# Altium schematic sheet ShiftRegs.SchDoc
size A3
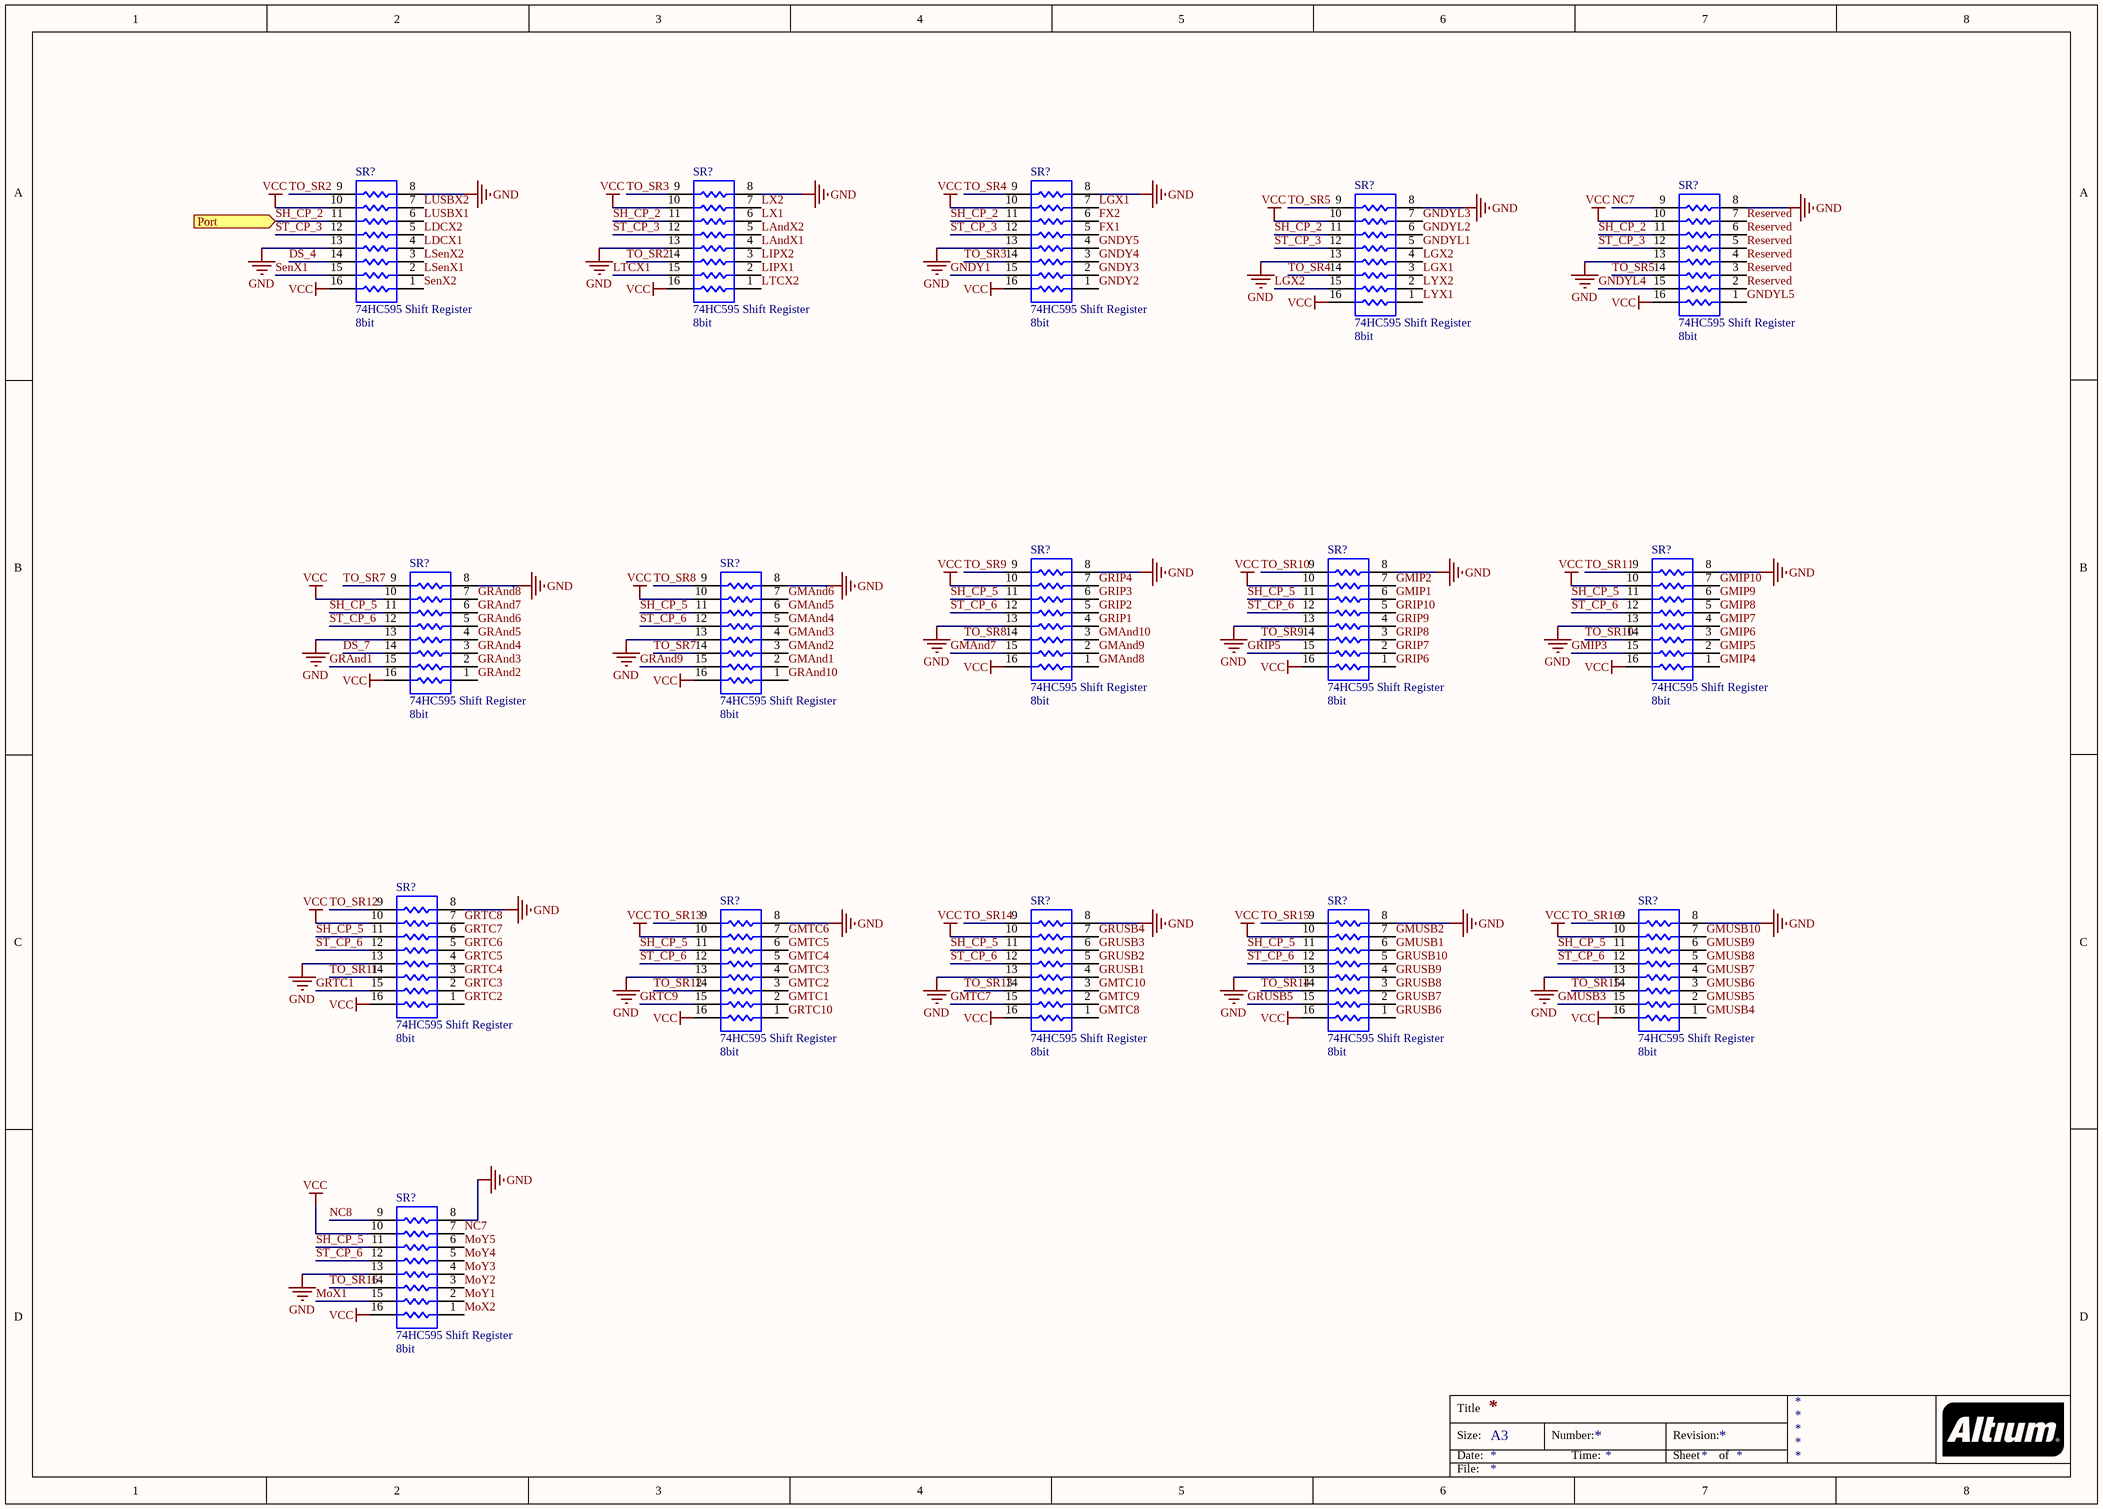
[diagram p0: ShiftRegs.SchDoc]

## Parts
(Parts that share a designator on the sheet are numbered #1, #2 ... from top to bottom, then left to right.)
SR?#1  74HC595 Shift Register  value 8bit  [SO-16_L]
SR?#2  74HC595 Shift Register  value 8bit  [SO-16_L]
SR?#3  74HC595 Shift Register  value 8bit  [SO-16_L]
SR?#4  74HC595 Shift Register  value 8bit  [SO-16_L]
SR?#5  74HC595 Shift Register  value 8bit  [SO-16_L]
SR?#6  74HC595 Shift Register  value 8bit  [SO-16_L]
SR?#7  74HC595 Shift Register  value 8bit  [SO-16_L]
SR?#8  74HC595 Shift Register  value 8bit  [SO-16_L]
SR?#9  74HC595 Shift Register  value 8bit  [SO-16_L]
SR?#10  74HC595 Shift Register  value 8bit  [SO-16_L]
SR?#11  74HC595 Shift Register  value 8bit  [SO-16_L]
SR?#12  74HC595 Shift Register  value 8bit  [SO-16_L]
SR?#13  74HC595 Shift Register  value 8bit  [SO-16_L]
SR?#14  74HC595 Shift Register  value 8bit  [SO-16_L]
SR?#15  74HC595 Shift Register  value 8bit  [SO-16_L]
SR?#16  74HC595 Shift Register  value 8bit  [SO-16_L]

## Ports
Port (in)

## Nets
GND: SR?#1.8 SR?#1.13 SR?#2.8 SR?#2.13 SR?#3.8 SR?#3.13 SR?#4.8 SR?#4.13 SR?#5.8 SR?#5.13 SR?#6.8 SR?#6.13 SR?#7.8 SR?#7.13 SR?#8.8 SR?#8.13 SR?#9.8 SR?#9.13 SR?#10.8 SR?#10.13 SR?#11.8 SR?#11.13 SR?#12.8 SR?#12.13 SR?#13.8 SR?#13.13 SR?#14.8 SR?#14.13 SR?#15.8 SR?#15.13 SR?#16.8 SR?#16.13
VCC: SR?#1.10 SR?#1.16 SR?#2.10 SR?#2.16 SR?#3.10 SR?#3.16 SR?#4.10 SR?#4.16 SR?#5.10 SR?#5.16 SR?#6.10 SR?#6.16 SR?#7.10 SR?#7.16 SR?#8.10 SR?#8.16 SR?#9.10 SR?#9.16 SR?#10.10 SR?#10.16 SR?#11.10 SR?#11.16 SR?#12.10 SR?#12.16 SR?#13.10 SR?#13.16 SR?#14.10 SR?#14.16 SR?#15.10 SR?#15.16 SR?#16.10 SR?#16.16
DS_4: SR?#1.14
DS_7: SR?#9.14
FX1: SR?#3.5
FX2: SR?#3.6
GMAnd1: SR?#10.2
GMAnd2: SR?#10.3
GMAnd3: SR?#10.4
GMAnd4: SR?#10.5
GMAnd5: SR?#10.6
GMAnd6: SR?#10.7
GMAnd7: SR?#6.15
GMAnd8: SR?#6.1
GMAnd9: SR?#6.2
GMAnd10: SR?#6.3
GMIP1: SR?#7.6
GMIP2: SR?#7.7
GMIP3: SR?#8.15
GMIP4: SR?#8.1
GMIP5: SR?#8.2
GMIP6: SR?#8.3
GMIP7: SR?#8.4
GMIP8: SR?#8.5
GMIP9: SR?#8.6
GMIP10: SR?#8.7
GMTC1: SR?#12.2
GMTC2: SR?#12.3
GMTC3: SR?#12.4
GMTC4: SR?#12.5
GMTC5: SR?#12.6
GMTC6: SR?#12.7
GMTC7: SR?#13.15
GMTC8: SR?#13.1
GMTC9: SR?#13.2
GMTC10: SR?#13.3
GMUSB1: SR?#14.6
GMUSB2: SR?#14.7
GMUSB3: SR?#15.15
GMUSB4: SR?#15.1
GMUSB5: SR?#15.2
GMUSB6: SR?#15.3
GMUSB7: SR?#15.4
GMUSB8: SR?#15.5
GMUSB9: SR?#15.6
GMUSB10: SR?#15.7
GNDY1: SR?#3.15
GNDY2: SR?#3.1
GNDY3: SR?#3.2
GNDY4: SR?#3.3
GNDY5: SR?#3.4
GNDYL1: SR?#4.5
GNDYL2: SR?#4.6
GNDYL3: SR?#4.7
GNDYL4: SR?#5.15
GNDYL5: SR?#5.1
GRAnd1: SR?#9.15
GRAnd2: SR?#9.1
GRAnd3: SR?#9.2
GRAnd4: SR?#9.3
GRAnd5: SR?#9.4
GRAnd6: SR?#9.5
GRAnd7: SR?#9.6
GRAnd8: SR?#9.7
GRAnd9: SR?#10.15
GRAnd10: SR?#10.1
GRIP1: SR?#6.4
GRIP2: SR?#6.5
GRIP3: SR?#6.6
GRIP4: SR?#6.7
GRIP5: SR?#7.15
GRIP6: SR?#7.1
GRIP7: SR?#7.2
GRIP8: SR?#7.3
GRIP9: SR?#7.4
GRIP10: SR?#7.5
GRTC1: SR?#11.15
GRTC2: SR?#11.1
GRTC3: SR?#11.2
GRTC4: SR?#11.3
GRTC5: SR?#11.4
GRTC6: SR?#11.5
GRTC7: SR?#11.6
GRTC8: SR?#11.7
GRTC9: SR?#12.15
GRTC10: SR?#12.1
GRUSB1: SR?#13.4
GRUSB2: SR?#13.5
GRUSB3: SR?#13.6
GRUSB4: SR?#13.7
GRUSB5: SR?#14.15
GRUSB6: SR?#14.1
GRUSB7: SR?#14.2
GRUSB8: SR?#14.3
GRUSB9: SR?#14.4
GRUSB10: SR?#14.5
LAndX1: SR?#2.4
LAndX2: SR?#2.5
LDCX1: SR?#1.4
LDCX2: SR?#1.5
LGX1: SR?#3.7 SR?#4.3
LGX2: SR?#4.4 SR?#4.15
LIPX1: SR?#2.2
LIPX2: SR?#2.3
LSenX1: SR?#1.2
LSenX2: SR?#1.3
LTCX1: SR?#2.15
LTCX2: SR?#2.1
LUSBX1: SR?#1.6
LUSBX2: SR?#1.7
LX1: SR?#2.6
LX2: SR?#2.7
LYX1: SR?#4.1
LYX2: SR?#4.2
MoX1: SR?#16.15
MoX2: SR?#16.1
MoY1: SR?#16.2
MoY2: SR?#16.3
MoY3: SR?#16.4
MoY4: SR?#16.5
MoY5: SR?#16.6
NC7: SR?#5.9 SR?#16.7
NC8: SR?#16.9
Reserved: SR?#5.2 SR?#5.3 SR?#5.4 SR?#5.5 SR?#5.6 SR?#5.7
SenX1: SR?#1.15
SenX2: SR?#1.1
SH_CP_2: SR?#1.11 SR?#2.11 SR?#3.11 SR?#4.11 SR?#5.11 ; port Port
SH_CP_5: SR?#6.11 SR?#7.11 SR?#8.11 SR?#9.11 SR?#10.11 SR?#11.11 SR?#12.11 SR?#13.11 SR?#14.11 SR?#15.11 SR?#16.11
ST_CP_3: SR?#1.12 SR?#2.12 SR?#3.12 SR?#4.12 SR?#5.12
ST_CP_6: SR?#6.12 SR?#7.12 SR?#8.12 SR?#9.12 SR?#10.12 SR?#11.12 SR?#12.12 SR?#13.12 SR?#14.12 SR?#15.12 SR?#16.12
TO_SR2: SR?#1.9 SR?#2.14
TO_SR3: SR?#2.9 SR?#3.14
TO_SR4: SR?#3.9 SR?#4.14
TO_SR5: SR?#4.9 SR?#5.14
TO_SR7: SR?#9.9 SR?#10.14
TO_SR8: SR?#6.14 SR?#10.9
TO_SR9: SR?#6.9 SR?#7.14
TO_SR10: SR?#7.9 SR?#8.14
TO_SR11: SR?#8.9 SR?#11.14
TO_SR12: SR?#11.9 SR?#12.14
TO_SR13: SR?#12.9 SR?#13.14
TO_SR14: SR?#13.9 SR?#14.14
TO_SR15: SR?#14.9 SR?#15.14
TO_SR16: SR?#15.9 SR?#16.14

## Notes on the sheet
- Title
- Size:
- Date:
- A3
- Number:
- Time:
- Revision:
- Sheet
- of
- File:

## Library data of the parts
SR?#1-SR?#16 = Res Pack3: Isolated Resistor Network; Published: 24-Mar-1999; LatestRevisionDate: 29-May-2009; LatestRevisionNote: IPC-7351 Footprint Added.; PackageReference: SO-16; Publisher: Altium Limited; PackageDescription: 16-Pin Small Outline Integrated Circuit 1.27 mm Pitch; Code_JEDEC: MS-012-AC; Code_IPC: SOIC127P600-16